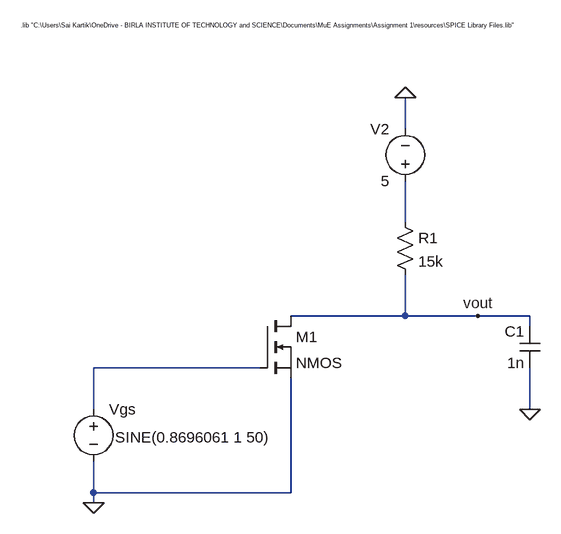
[diagram p0: schematic question1.asc]
question1.asc, the LTspice schematic file:
Version 4
SHEET 1 2480 680
WIRE 400 -32 400 -80
WIRE 400 112 400 48
WIRE 400 256 400 192
WIRE 400 256 224 256
WIRE 512 256 400 256
WIRE 592 256 512 256
WIRE 592 272 592 256
WIRE 176 336 -80 336
WIRE -80 400 -80 336
WIRE 592 400 592 336
WIRE -80 528 -80 480
WIRE 224 528 224 352
WIRE 224 528 -80 528
WIRE -80 544 -80 528
FLAG -80 544 0
FLAG 400 -80 0
FLAG 592 400 0
FLAG 512 256 vout
SYMBOL voltage -80 384 R0
WINDOW 3 33 59 Left 2
WINDOW 123 0 0 Left 0
WINDOW 39 0 0 Left 0
SYMATTR InstName Vgs
SYMATTR Value SINE(0.8696061 1 50)
SYMBOL voltage 400 64 R180
WINDOW 0 24 96 Left 2
WINDOW 3 24 16 Left 2
WINDOW 123 0 0 Left 0
WINDOW 39 0 0 Left 0
SYMATTR InstName V2
SYMATTR Value 5
SYMBOL nmos 176 256 R0
SYMATTR InstName M1
SYMBOL res 384 96 R0
SYMATTR InstName R1
SYMATTR Value 15k
SYMBOL cap 608 336 R180
WINDOW 0 24 56 Left 2
WINDOW 3 24 8 Left 2
SYMATTR InstName C1
SYMATTR Value 1n
TEXT -192 -192 Left 0 !.lib "C:\\Users\\Sai Kartik\\OneDrive - BIRLA INSTITUTE OF TECHNOLOGY and SCIENCE\\Documents\\MuE Assignments\\Assignment 1\\resources\\SPICE Library Files.lib"

The netlist it stands for:
* question1.asc
Vgs N002 0 SINE(0.8696061 1 50)
V2 N001 0 5
M1 vout N002 0 0 NMOS
R1 N001 vout 15k
C1 0 vout 1n
.model NMOS NMOS
.model PMOS PMOS
.lib standard.mos
.lib "C:\Users\Sai Kartik\OneDrive - BIRLA INSTITUTE OF TECHNOLOGY and SCIENCE\Documents\MuE Assignments\Assignment 1\resources\SPICE Library Files.lib"
.backanno
.end